# EAGLE design connector (EAGLE 6.4)
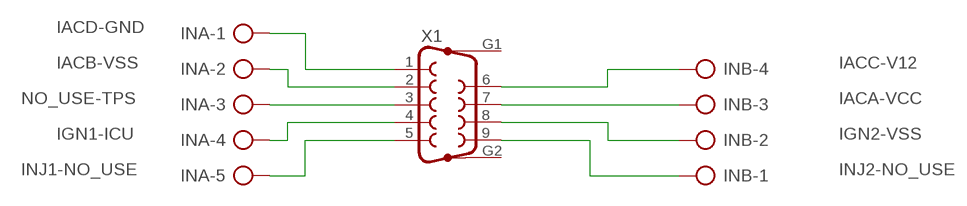
[diagram p0: schematic, sheet 1]

## Parts
INA  AK500/5  [AK500/5]
INB  AK500/4  [AK500/4]
X1  F09HP  [F09HP]

## Nets
IACA-VCC: INB.3 X1.7
IACB-VSS: INA.2 X1.2
IACC-V12: INB.4 X1.6
IACD-GND: INA.1 X1.1
IGN1-ICU: INA.4 X1.4
IGN2-VSS: INB.2 X1.8
INJ1-NO_USE: INA.5 X1.5
INJ2-NO_USE: INB.1 X1.9
NO_USE-TPS: INA.3 X1.3
Unconnected: X1.G1 X1.G2

## Library data of the parts
INA = con-ptr500:AK500/5: CONNECTOR; OC_FARNELL: unknown; OC_NEWARK: unknown
INB = con-ptr500:AK500/4: CONNECTOR; OC_FARNELL: unknown; OC_NEWARK: unknown
X1 = con-subd:F09HP: SUB-D; OC_FARNELL: unknown; OC_NEWARK: unknown

## Board
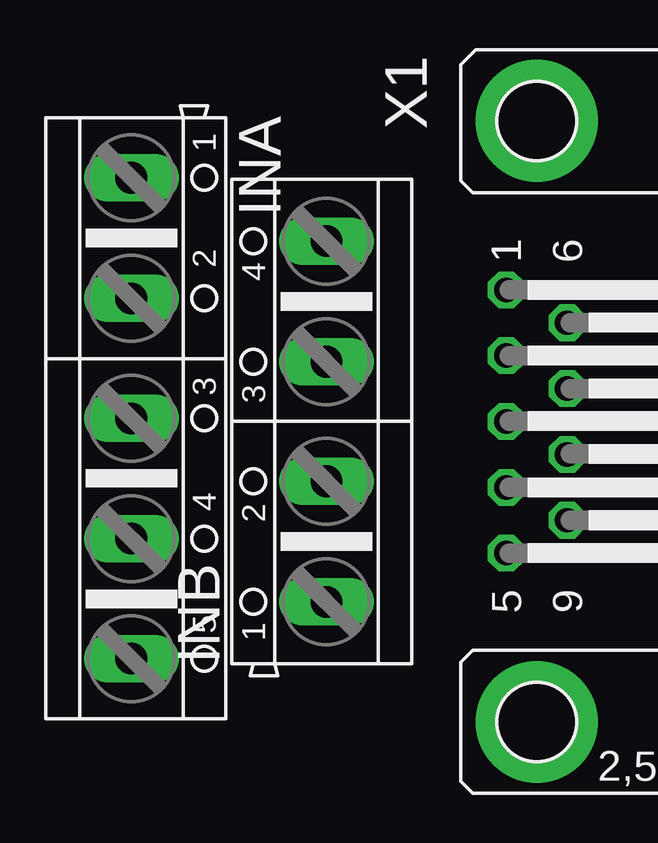
[diagram p1: board, top side]
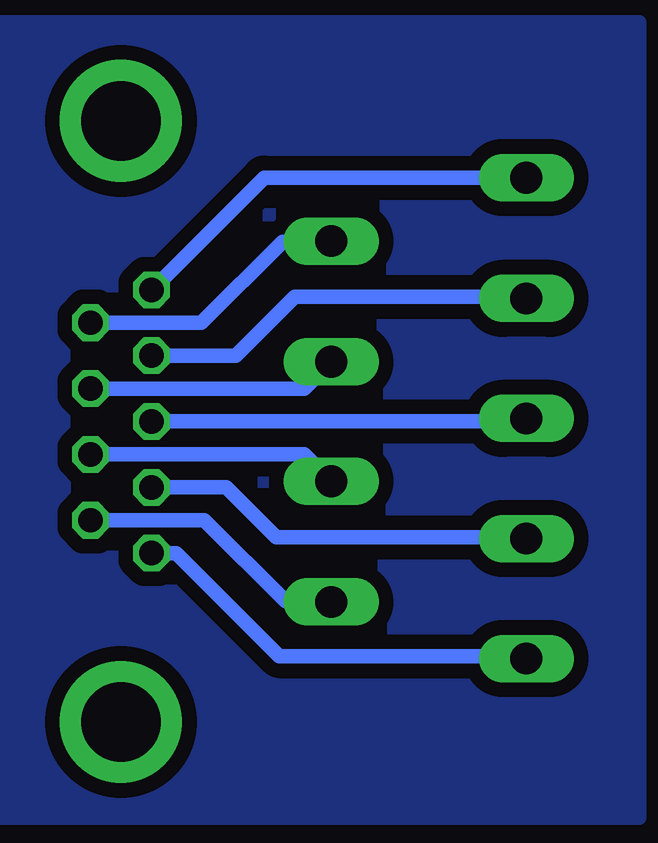
[diagram p2: board, bottom side, seen from below]

No outline drawn. Coordinates in mm, seen from the top.
Copper layers (1*16): Top 0.035mm / dielectric 1.5mm / Bottom 0.035mm
Design rules "default": minimum track width 10mil, minimum drill 24mil, track to track 8mil, track to pad 8mil, pad to pad 8mil, via to via 8mil, smd to smd 8mil, copper to edge 40mil, drill to drill 8mil, minimum pad ring 10mil, minimum via ring 8mil, stop-mask expansion 4mil, vias tented up to drill 0mil, thermal gap 10mil

### Footprints (pad centres in the part's own frame; a part is rotated, then mirrored left to right if it is on the bottom)
AK500/5 = drill 1.321 long: 1 -10.033,0; 2 -5.004,0; 3 0,0; 4 5.004,0; 5 10.008,0
AK500/4 = drill 1.321 long: 1 -7.518,0; 2 -2.489,0; 3 2.489,0; 4 7.518,0
F09HP = drill 1.016 octagon: 1 -5.486,-1.27; 2 -2.743,-1.27; 3 0,-1.27; 4 2.743,-1.27; 5 5.486,-1.27; 6 -4.115,1.27; 7 -1.372,1.27; 8 1.372,1.27; 9 4.115,1.27 | drill 3.302 pad 5.08: G1 -12.522,0; G2 12.522,0

### Placement (x,y rotation side)
INA  35.56,38.1 270 top
INB  43.69,37.97 90 top
X1  52.45,37.97 270 top

### Tracks (layer width: path | path; a pad name or v marks a point on that pad's centre or on a via)
IACA-VCC
  Bottom 0.61: X1.7 44.81,39.34 INB.3
IACB-VSS
  Bottom 0.61: X1.2 47.68,40.72 45.21,43.18 35.64,43.18 INA.2
IACC-V12
  Bottom 0.61: X1.6 49.1,42.09 45.72,45.47 43.71,45.47 INB.4
IACD-GND
  Bottom 0.61: X1.1 51.16,43.46 46.48,48.13 INA.1
IGN1-ICU
  Bottom 0.61: X1.4 48.06,35.23 45.97,33.15 35.61,33.15 INA.4
IGN2-VSS
  Bottom 0.61: X1.8 44.81,36.6 INB.2
INJ1-NO_USE
  Bottom 0.61: X1.5 50.14,32.49 45.85,28.19 35.66,28.19 INA.5
INJ2-NO_USE
  Bottom 0.61: X1.9 48.97,33.86 45.59,30.48 43.71,30.48 INB.1
N$10
  pour Bottom (isolate 0.61): 30.86,54.61 59.94,54.61 59.94,21.46 30.86,21.46
NO_USE-TPS
  Bottom 0.61: X1.3 35.69,37.97 INA.3